# EAGLE schematic mcp3426_sample (EAGLE 8.2.1)
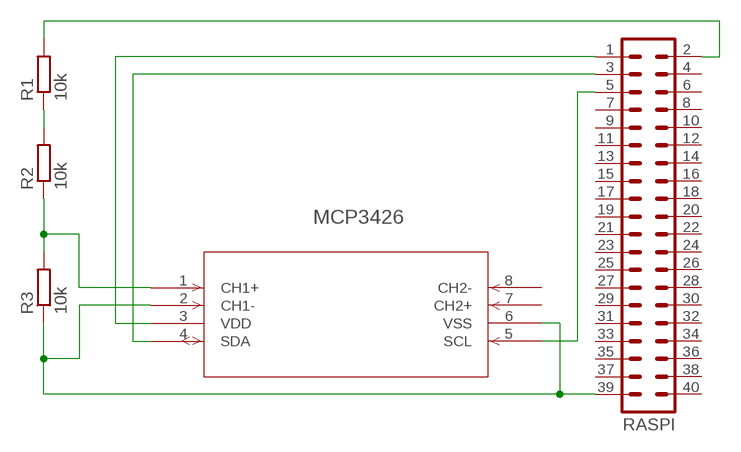
[diagram p0: schematic, sheet 1]

## Parts
MCP3426  MCP3422-XXXX_MS  [MSOP8_MC]
R1  10k  R-EU_0207/10  [0207/10]
R2  10k  R-EU_0207/10  [0207/10]
R3  10k  R-EU_0207/10  [0207/10]
RASPI  ML40  [ML40]

## Nets
N$1: MCP3426.4(SDA) RASPI.3
N$2: MCP3426.5(SCL) RASPI.5
N$3: R1.1 R2.2
N$4: MCP3426.3(VDD) RASPI.1
N$5: R1.2 RASPI.2
N$6: MCP3426.1(CH1+) R2.1 R3.2
N$7: MCP3426.2(CH1-) MCP3426.6(VSS) R3.1 RASPI.39
Unconnected: MCP3426.7(CH2+) MCP3426.8(CH2-) RASPI.4 RASPI.6 RASPI.7 RASPI.8 RASPI.9 RASPI.10 RASPI.11 RASPI.12 RASPI.13 RASPI.14 RASPI.15 RASPI.16 RASPI.17 RASPI.18 RASPI.19 RASPI.20 RASPI.21 RASPI.22 RASPI.23 RASPI.24 RASPI.25 RASPI.26 RASPI.27 RASPI.28 RASPI.29 RASPI.30 RASPI.31 RASPI.32 RASPI.33 RASPI.34 RASPI.35 RASPI.36 RASPI.37 RASPI.38 RASPI.40

## Library data of the parts
MCP3426 = mcp3426:MCP3422-XXXX_MS: analog digital converter MCP3426
R1-R3 = rcl:R-EU_: RESISTOR, European symbol
RASPI = con-ml:ML40: HARTING; OC_FARNELL: unknown; OC_NEWARK: unknown